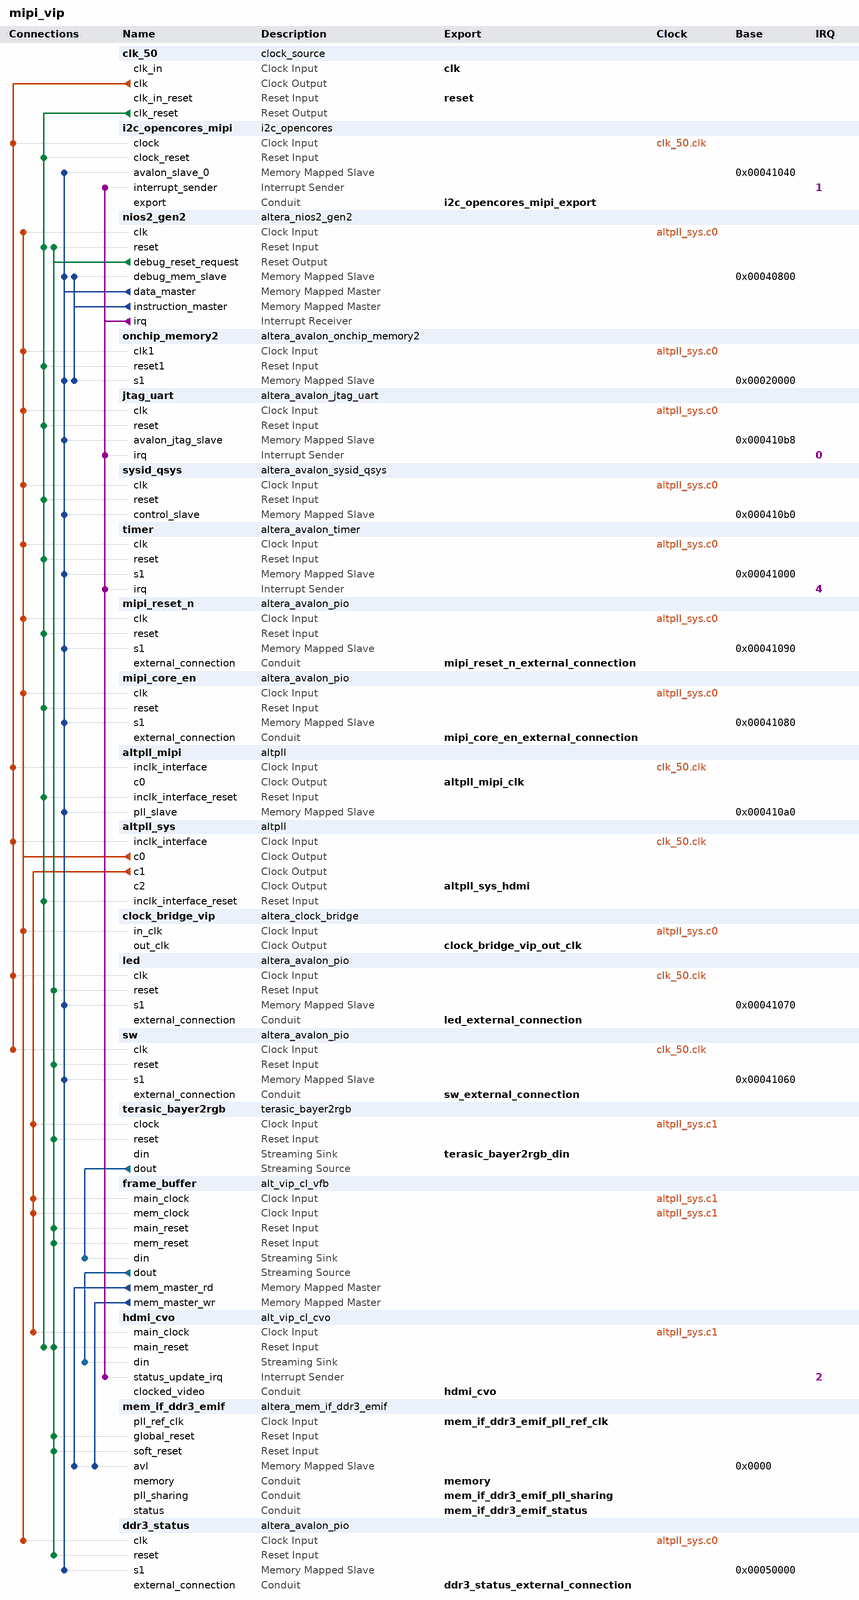
[diagram p0: system contents]
# Platform Designer (Qsys) system mipi_vip, MAX 10 10M50DAF484C6GES
# Parameters at their usual value, and those the tool derives, are not listed.
package require -exact qsys 15.0
create_system mipi_vip
set_project_property DEVICE_FAMILY {MAX 10}
set_project_property DEVICE 10M50DAF484C6GES

add_instance clk_50 clock_source 15.0
set_instance_parameter_value clk_50 clockFrequency 50000000

add_instance i2c_opencores_mipi i2c_opencores 12.0

add_instance nios2_gen2 altera_nios2_gen2 15.0
set_instance_parameter_value nios2_gen2 dcache_size 2048
set_instance_parameter_value nios2_gen2 exceptionSlave onchip_memory2.s1
set_instance_parameter_value nios2_gen2 icache_size 4096
set_instance_parameter_value nios2_gen2 impl Fast
set_instance_parameter_value nios2_gen2 resetSlave onchip_memory2.s1

add_instance onchip_memory2 altera_avalon_onchip_memory2 15.0
set_instance_parameter_value onchip_memory2 dataWidth 32
set_instance_parameter_value onchip_memory2 dualPort false
set_instance_parameter_value onchip_memory2 initMemContent true
set_instance_parameter_value onchip_memory2 initializationFileName "E:\\SVN\\deca\\amax10\\test\\richard\\DECA_MIPI\\software\\deca_mipi\\mem_init\\deca_qsys_onchip_memory2.hex"
set_instance_parameter_value onchip_memory2 memorySize 70000

add_instance jtag_uart altera_avalon_jtag_uart 15.0
set_instance_parameter_value jtag_uart simInteractiveOptions NO_INTERACTIVE_WINDOWS

add_instance sysid_qsys altera_avalon_sysid_qsys 15.0
set_instance_parameter_value sysid_qsys id 0

add_instance timer altera_avalon_timer 15.0
set_instance_parameter_value timer period 1
set_instance_parameter_value timer periodUnits MSEC

add_instance mipi_reset_n altera_avalon_pio 15.0
set_instance_parameter_value mipi_reset_n direction Output
set_instance_parameter_value mipi_reset_n resetValue 1
set_instance_parameter_value mipi_reset_n width 1

add_instance mipi_core_en altera_avalon_pio 15.0
set_instance_parameter_value mipi_core_en direction Output
set_instance_parameter_value mipi_core_en resetValue 1
set_instance_parameter_value mipi_core_en width 1

add_instance altpll_mipi altpll 15.0
set_instance_parameter_value altpll_mipi CLK0_DIVIDE_BY 25
set_instance_parameter_value altpll_mipi CLK0_MULTIPLY_BY 12
set_instance_parameter_value altpll_mipi INCLK0_INPUT_FREQUENCY 20000
set_instance_parameter_value altpll_mipi PORT_ARESET PORT_UNUSED
set_instance_parameter_value altpll_mipi PORT_LOCKED PORT_USED
set_instance_parameter_value altpll_mipi PORT_clk1 PORT_UNUSED
set_instance_parameter_value altpll_mipi PORT_clk2 PORT_UNUSED
set_instance_parameter_value altpll_mipi PORT_clk3 PORT_UNUSED

add_instance altpll_sys altpll 15.0
set_instance_parameter_value altpll_sys CLK0_DIVIDE_BY 1
set_instance_parameter_value altpll_sys CLK0_MULTIPLY_BY 2
set_instance_parameter_value altpll_sys CLK1_DIVIDE_BY 1
set_instance_parameter_value altpll_sys CLK1_DUTY_CYCLE 50
set_instance_parameter_value altpll_sys CLK1_MULTIPLY_BY 2
set_instance_parameter_value altpll_sys CLK1_PHASE_SHIFT 0
set_instance_parameter_value altpll_sys CLK2_DIVIDE_BY 10
set_instance_parameter_value altpll_sys CLK2_DUTY_CYCLE 50
set_instance_parameter_value altpll_sys CLK2_MULTIPLY_BY 13
set_instance_parameter_value altpll_sys CLK2_PHASE_SHIFT 0
set_instance_parameter_value altpll_sys INCLK0_INPUT_FREQUENCY 20000
set_instance_parameter_value altpll_sys PORT_ARESET PORT_UNUSED
set_instance_parameter_value altpll_sys PORT_LOCKED PORT_USED
set_instance_parameter_value altpll_sys PORT_clk1 PORT_USED
set_instance_parameter_value altpll_sys PORT_clk2 PORT_USED
set_instance_parameter_value altpll_sys PORT_clk3 PORT_UNUSED

add_instance clock_bridge_vip altera_clock_bridge 15.0
set_instance_parameter_value clock_bridge_vip DERIVED_CLOCK_RATE 100000000
set_instance_parameter_value clock_bridge_vip EXPLICIT_CLOCK_RATE 100000000

add_instance led altera_avalon_pio 15.0
set_instance_parameter_value led direction Output
set_instance_parameter_value led width 8

add_instance sw altera_avalon_pio 15.0
set_instance_parameter_value sw direction Input
set_instance_parameter_value sw width 2

add_instance terasic_bayer2rgb terasic_bayer2rgb 1.0
set_instance_parameter_value terasic_bayer2rgb RAW_BITS 8
set_instance_parameter_value terasic_bayer2rgb VIDEO_H 768
set_instance_parameter_value terasic_bayer2rgb VIDEO_W 1024

add_instance frame_buffer alt_vip_cl_vfb 15.0
set_instance_parameter_value frame_buffer CLOCKS_ARE_SEPARATE 1
set_instance_parameter_value frame_buffer CORRECT_INVALID_FIELDS 0
set_instance_parameter_value frame_buffer DROP_FRAMES 0
set_instance_parameter_value frame_buffer FAMILY {MAX 10}
set_instance_parameter_value frame_buffer IS_FRAME_READER 0
set_instance_parameter_value frame_buffer MAX_HEIGHT 768
set_instance_parameter_value frame_buffer MAX_WIDTH 1024
set_instance_parameter_value frame_buffer MEM_BASE_ADDR 0
set_instance_parameter_value frame_buffer MEM_PORT_WIDTH 128
set_instance_parameter_value frame_buffer READER_RUNTIME_CONTROL 0
set_instance_parameter_value frame_buffer READ_BURST_TARGET 64
set_instance_parameter_value frame_buffer READ_FIFO_DEPTH 128
set_instance_parameter_value frame_buffer USER_PACKETS_MAX_STORAGE 0
set_instance_parameter_value frame_buffer WRITE_BURST_TARGET 64
set_instance_parameter_value frame_buffer WRITE_FIFO_DEPTH 128

add_instance hdmi_cvo alt_vip_cl_cvo 15.0
set_instance_parameter_value hdmi_cvo ACCEPT_COLOURS_IN_SEQ 0
set_instance_parameter_value hdmi_cvo ANC_LINE 0
set_instance_parameter_value hdmi_cvo AP_LINE 0
set_instance_parameter_value hdmi_cvo BPS 8
set_instance_parameter_value hdmi_cvo CLOCKS_ARE_SAME 0
set_instance_parameter_value hdmi_cvo COLOUR_PLANES_ARE_IN_PARALLEL 1
set_instance_parameter_value hdmi_cvo CONTEXT_WIDTH 8
set_instance_parameter_value hdmi_cvo DST_WIDTH 8
set_instance_parameter_value hdmi_cvo FIELD0_ANC_LINE 0
set_instance_parameter_value hdmi_cvo FIELD0_V_BACK_PORCH 0
set_instance_parameter_value hdmi_cvo FIELD0_V_BLANK 0
set_instance_parameter_value hdmi_cvo FIELD0_V_FRONT_PORCH 0
set_instance_parameter_value hdmi_cvo FIELD0_V_RISING_EDGE 0
set_instance_parameter_value hdmi_cvo FIELD0_V_SYNC_LENGTH 0
set_instance_parameter_value hdmi_cvo FIFO_DEPTH 1024
set_instance_parameter_value hdmi_cvo F_FALLING_EDGE 0
set_instance_parameter_value hdmi_cvo F_RISING_EDGE 0
set_instance_parameter_value hdmi_cvo GENERATE_SYNC 0
set_instance_parameter_value hdmi_cvo H_ACTIVE_PIXELS 1024
set_instance_parameter_value hdmi_cvo H_BACK_PORCH 160
set_instance_parameter_value hdmi_cvo H_BLANK 0
set_instance_parameter_value hdmi_cvo H_FRONT_PORCH 24
set_instance_parameter_value hdmi_cvo H_SYNC_LENGTH 136
set_instance_parameter_value hdmi_cvo INTERLACED 0
set_instance_parameter_value hdmi_cvo NO_OF_CHANNELS 1
set_instance_parameter_value hdmi_cvo NO_OF_MODES 1
set_instance_parameter_value hdmi_cvo NUMBER_OF_COLOUR_PLANES 3
set_instance_parameter_value hdmi_cvo PIXELS_IN_PARALLEL 1
set_instance_parameter_value hdmi_cvo SRC_WIDTH 8
set_instance_parameter_value hdmi_cvo STD_WIDTH 1
set_instance_parameter_value hdmi_cvo TASK_WIDTH 8
set_instance_parameter_value hdmi_cvo THRESHOLD 1023
set_instance_parameter_value hdmi_cvo USE_CONTROL 0
set_instance_parameter_value hdmi_cvo USE_EMBEDDED_SYNCS 0
set_instance_parameter_value hdmi_cvo V_ACTIVE_LINES 768
set_instance_parameter_value hdmi_cvo V_BACK_PORCH 29
set_instance_parameter_value hdmi_cvo V_BLANK 0
set_instance_parameter_value hdmi_cvo V_FRONT_PORCH 3
set_instance_parameter_value hdmi_cvo V_SYNC_LENGTH 6

add_instance mem_if_ddr3_emif altera_mem_if_ddr3_emif 15.0
set_instance_parameter_value mem_if_ddr3_emif AVL_MAX_SIZE 4
set_instance_parameter_value mem_if_ddr3_emif CALIBRATION_MODE Skip
set_instance_parameter_value mem_if_ddr3_emif CPORT_TYPE_PORT Bidirectional,Bidirectional,Bidirectional,Bidirectional,Bidirectional,Bidirectional
set_instance_parameter_value mem_if_ddr3_emif EXPORT_AFI_HALF_CLK false
set_instance_parameter_value mem_if_ddr3_emif HARD_EMIF false
set_instance_parameter_value mem_if_ddr3_emif MEM_BANKADDR_WIDTH 3
set_instance_parameter_value mem_if_ddr3_emif MEM_CLK_FREQ 300.0
set_instance_parameter_value mem_if_ddr3_emif MEM_CLK_FREQ_MAX 800.0
set_instance_parameter_value mem_if_ddr3_emif MEM_COL_ADDR_WIDTH 10
set_instance_parameter_value mem_if_ddr3_emif MEM_DQ_WIDTH 16
set_instance_parameter_value mem_if_ddr3_emif MEM_FORMAT DISCRETE
set_instance_parameter_value mem_if_ddr3_emif MEM_ROW_ADDR_WIDTH 15
set_instance_parameter_value mem_if_ddr3_emif MEM_TCL 7
set_instance_parameter_value mem_if_ddr3_emif MEM_TFAW_NS 45.0
set_instance_parameter_value mem_if_ddr3_emif MEM_TRAS_NS 35.0
set_instance_parameter_value mem_if_ddr3_emif MEM_TRCD_NS 13.75
set_instance_parameter_value mem_if_ddr3_emif MEM_TRFC_NS 260.0
set_instance_parameter_value mem_if_ddr3_emif MEM_TRP_NS 13.75
set_instance_parameter_value mem_if_ddr3_emif MEM_TRRD_NS 7.5
set_instance_parameter_value mem_if_ddr3_emif MEM_TRTP_NS 7.5
set_instance_parameter_value mem_if_ddr3_emif MEM_TWTR 6
set_instance_parameter_value mem_if_ddr3_emif MEM_VENDOR Micron
set_instance_parameter_value mem_if_ddr3_emif MEM_WTCL 6
set_instance_parameter_value mem_if_ddr3_emif PLL_LOCATION Top_Bottom
set_instance_parameter_value mem_if_ddr3_emif POWER_OF_TWO_BUS true
set_instance_parameter_value mem_if_ddr3_emif PRIORITY_PORT 1,1,1,1,1,1
set_instance_parameter_value mem_if_ddr3_emif RATE Half
set_instance_parameter_value mem_if_ddr3_emif REF_CLK_FREQ 50.0
set_instance_parameter_value mem_if_ddr3_emif SPEED_GRADE 6
set_instance_parameter_value mem_if_ddr3_emif TIMING_BOARD_AC_SKEW 0.017
set_instance_parameter_value mem_if_ddr3_emif TIMING_BOARD_AC_TO_CK_SKEW -1.3E-4
set_instance_parameter_value mem_if_ddr3_emif TIMING_BOARD_DQ_TO_DQS_SKEW -6.0E-4
set_instance_parameter_value mem_if_ddr3_emif TIMING_BOARD_MAX_CK_DELAY 0.183
set_instance_parameter_value mem_if_ddr3_emif TIMING_BOARD_MAX_DQS_DELAY 0.181
set_instance_parameter_value mem_if_ddr3_emif TIMING_BOARD_SKEW_BETWEEN_DQS 0.005
set_instance_parameter_value mem_if_ddr3_emif TIMING_BOARD_SKEW_CKDQS_DIMM_MAX 0.007
set_instance_parameter_value mem_if_ddr3_emif TIMING_BOARD_SKEW_CKDQS_DIMM_MIN 0.002
set_instance_parameter_value mem_if_ddr3_emif TIMING_BOARD_SKEW_WITHIN_DQS 0.008
set_instance_parameter_value mem_if_ddr3_emif TIMING_TDH 55
set_instance_parameter_value mem_if_ddr3_emif TIMING_TDQSCK 225
set_instance_parameter_value mem_if_ddr3_emif TIMING_TDQSQ 125
set_instance_parameter_value mem_if_ddr3_emif TIMING_TDQSS 0.25
set_instance_parameter_value mem_if_ddr3_emif TIMING_TDS 55
set_instance_parameter_value mem_if_ddr3_emif TIMING_TDSH 0.2
set_instance_parameter_value mem_if_ddr3_emif TIMING_TDSS 0.2
set_instance_parameter_value mem_if_ddr3_emif TIMING_TIH 130
set_instance_parameter_value mem_if_ddr3_emif TIMING_TIS 185
set_instance_parameter_value mem_if_ddr3_emif TIMING_TQSH 0.4
set_instance_parameter_value mem_if_ddr3_emif USER_DEBUG_LEVEL 1

add_instance ddr3_status altera_avalon_pio 15.0
set_instance_parameter_value ddr3_status direction Input
set_instance_parameter_value ddr3_status width 4

# connections
add_connection altpll_sys.c0 clock_bridge_vip.in_clk clock
add_connection altpll_sys.c0 ddr3_status.clk clock
add_connection altpll_sys.c0 jtag_uart.clk clock
add_connection altpll_sys.c0 mipi_core_en.clk clock
add_connection altpll_sys.c0 mipi_reset_n.clk clock
add_connection altpll_sys.c0 nios2_gen2.clk clock
add_connection altpll_sys.c0 onchip_memory2.clk1 clock
add_connection altpll_sys.c0 sysid_qsys.clk clock
add_connection altpll_sys.c0 timer.clk clock
add_connection altpll_sys.c1 frame_buffer.main_clock clock
add_connection altpll_sys.c1 frame_buffer.mem_clock clock
add_connection altpll_sys.c1 hdmi_cvo.main_clock clock
add_connection altpll_sys.c1 terasic_bayer2rgb.clock clock
add_connection clk_50.clk altpll_mipi.inclk_interface clock
add_connection clk_50.clk altpll_sys.inclk_interface clock
add_connection clk_50.clk i2c_opencores_mipi.clock clock
add_connection clk_50.clk led.clk clock
add_connection clk_50.clk sw.clk clock
add_connection clk_50.clk_reset altpll_mipi.inclk_interface_reset reset
add_connection clk_50.clk_reset altpll_sys.inclk_interface_reset reset
add_connection clk_50.clk_reset hdmi_cvo.main_reset reset
add_connection clk_50.clk_reset i2c_opencores_mipi.clock_reset reset
add_connection clk_50.clk_reset jtag_uart.reset reset
add_connection clk_50.clk_reset mipi_core_en.reset reset
add_connection clk_50.clk_reset mipi_reset_n.reset reset
add_connection clk_50.clk_reset nios2_gen2.reset reset
add_connection clk_50.clk_reset onchip_memory2.reset1 reset
add_connection clk_50.clk_reset sysid_qsys.reset reset
add_connection clk_50.clk_reset timer.reset reset
add_connection nios2_gen2.debug_reset_request ddr3_status.reset reset
add_connection nios2_gen2.debug_reset_request frame_buffer.main_reset reset
add_connection nios2_gen2.debug_reset_request frame_buffer.mem_reset reset
add_connection nios2_gen2.debug_reset_request hdmi_cvo.main_reset reset
add_connection nios2_gen2.debug_reset_request led.reset reset
add_connection nios2_gen2.debug_reset_request mem_if_ddr3_emif.global_reset reset
add_connection nios2_gen2.debug_reset_request mem_if_ddr3_emif.soft_reset reset
add_connection nios2_gen2.debug_reset_request nios2_gen2.reset reset
add_connection nios2_gen2.debug_reset_request sw.reset reset
add_connection nios2_gen2.debug_reset_request terasic_bayer2rgb.reset reset
add_connection frame_buffer.mem_master_rd mem_if_ddr3_emif.avl avalon
set_connection_parameter_value frame_buffer.mem_master_rd/mem_if_ddr3_emif.avl arbitrationPriority 10
set_connection_parameter_value frame_buffer.mem_master_rd/mem_if_ddr3_emif.avl baseAddress 0x0000
add_connection frame_buffer.mem_master_wr mem_if_ddr3_emif.avl avalon
set_connection_parameter_value frame_buffer.mem_master_wr/mem_if_ddr3_emif.avl arbitrationPriority 10
set_connection_parameter_value frame_buffer.mem_master_wr/mem_if_ddr3_emif.avl baseAddress 0x0000
add_connection nios2_gen2.data_master altpll_mipi.pll_slave avalon
set_connection_parameter_value nios2_gen2.data_master/altpll_mipi.pll_slave baseAddress 0x000410a0
add_connection nios2_gen2.data_master ddr3_status.s1 avalon
set_connection_parameter_value nios2_gen2.data_master/ddr3_status.s1 baseAddress 0x00050000
add_connection nios2_gen2.data_master i2c_opencores_mipi.avalon_slave_0 avalon
set_connection_parameter_value nios2_gen2.data_master/i2c_opencores_mipi.avalon_slave_0 baseAddress 0x00041040
add_connection nios2_gen2.data_master jtag_uart.avalon_jtag_slave avalon
set_connection_parameter_value nios2_gen2.data_master/jtag_uart.avalon_jtag_slave baseAddress 0x000410b8
add_connection nios2_gen2.data_master led.s1 avalon
set_connection_parameter_value nios2_gen2.data_master/led.s1 baseAddress 0x00041070
add_connection nios2_gen2.data_master mipi_core_en.s1 avalon
set_connection_parameter_value nios2_gen2.data_master/mipi_core_en.s1 baseAddress 0x00041080
add_connection nios2_gen2.data_master mipi_reset_n.s1 avalon
set_connection_parameter_value nios2_gen2.data_master/mipi_reset_n.s1 baseAddress 0x00041090
add_connection nios2_gen2.data_master nios2_gen2.debug_mem_slave avalon
set_connection_parameter_value nios2_gen2.data_master/nios2_gen2.debug_mem_slave baseAddress 0x00040800
add_connection nios2_gen2.data_master onchip_memory2.s1 avalon
set_connection_parameter_value nios2_gen2.data_master/onchip_memory2.s1 baseAddress 0x00020000
add_connection nios2_gen2.data_master sw.s1 avalon
set_connection_parameter_value nios2_gen2.data_master/sw.s1 baseAddress 0x00041060
add_connection nios2_gen2.data_master sysid_qsys.control_slave avalon
set_connection_parameter_value nios2_gen2.data_master/sysid_qsys.control_slave baseAddress 0x000410b0
add_connection nios2_gen2.data_master timer.s1 avalon
set_connection_parameter_value nios2_gen2.data_master/timer.s1 baseAddress 0x00041000
add_connection nios2_gen2.instruction_master nios2_gen2.debug_mem_slave avalon
set_connection_parameter_value nios2_gen2.instruction_master/nios2_gen2.debug_mem_slave baseAddress 0x00040800
add_connection nios2_gen2.instruction_master onchip_memory2.s1 avalon
set_connection_parameter_value nios2_gen2.instruction_master/onchip_memory2.s1 baseAddress 0x00020000
add_connection frame_buffer.dout hdmi_cvo.din avalon_streaming
add_connection terasic_bayer2rgb.dout frame_buffer.din avalon_streaming
add_connection nios2_gen2.irq hdmi_cvo.status_update_irq interrupt
set_connection_parameter_value nios2_gen2.irq/hdmi_cvo.status_update_irq irqNumber 2
add_connection nios2_gen2.irq i2c_opencores_mipi.interrupt_sender interrupt
set_connection_parameter_value nios2_gen2.irq/i2c_opencores_mipi.interrupt_sender irqNumber 1
add_connection nios2_gen2.irq jtag_uart.irq interrupt
set_connection_parameter_value nios2_gen2.irq/jtag_uart.irq irqNumber 0
add_connection nios2_gen2.irq timer.irq interrupt
set_connection_parameter_value nios2_gen2.irq/timer.irq irqNumber 4

# exported interfaces
add_interface altpll_mipi_clk clock source
set_interface_property altpll_mipi_clk EXPORT_OF altpll_mipi.c0
add_interface altpll_sys_hdmi clock source
set_interface_property altpll_sys_hdmi EXPORT_OF altpll_sys.c2
add_interface clk clock sink
set_interface_property clk EXPORT_OF clk_50.clk_in
add_interface clock_bridge_vip_out_clk clock source
set_interface_property clock_bridge_vip_out_clk EXPORT_OF clock_bridge_vip.out_clk
add_interface ddr3_status_external_connection conduit end
set_interface_property ddr3_status_external_connection EXPORT_OF ddr3_status.external_connection
add_interface hdmi_cvo conduit end
set_interface_property hdmi_cvo EXPORT_OF hdmi_cvo.clocked_video
add_interface i2c_opencores_mipi_export conduit end
set_interface_property i2c_opencores_mipi_export EXPORT_OF i2c_opencores_mipi.export
add_interface led_external_connection conduit end
set_interface_property led_external_connection EXPORT_OF led.external_connection
add_interface mem_if_ddr3_emif_pll_ref_clk clock sink
set_interface_property mem_if_ddr3_emif_pll_ref_clk EXPORT_OF mem_if_ddr3_emif.pll_ref_clk
add_interface mem_if_ddr3_emif_pll_sharing conduit end
set_interface_property mem_if_ddr3_emif_pll_sharing EXPORT_OF mem_if_ddr3_emif.pll_sharing
add_interface mem_if_ddr3_emif_status conduit end
set_interface_property mem_if_ddr3_emif_status EXPORT_OF mem_if_ddr3_emif.status
add_interface memory conduit end
set_interface_property memory EXPORT_OF mem_if_ddr3_emif.memory
add_interface mipi_core_en_external_connection conduit end
set_interface_property mipi_core_en_external_connection EXPORT_OF mipi_core_en.external_connection
add_interface mipi_reset_n_external_connection conduit end
set_interface_property mipi_reset_n_external_connection EXPORT_OF mipi_reset_n.external_connection
add_interface reset reset sink
set_interface_property reset EXPORT_OF clk_50.clk_in_reset
add_interface sw_external_connection conduit end
set_interface_property sw_external_connection EXPORT_OF sw.external_connection
add_interface terasic_bayer2rgb_din avalon_streaming sink
set_interface_property terasic_bayer2rgb_din EXPORT_OF terasic_bayer2rgb.din

set_interconnect_requirement {$system} qsys_mm.clockCrossingAdapter HANDSHAKE
set_interconnect_requirement {$system} qsys_mm.insertDefaultSlave FALSE
set_interconnect_requirement {$system} qsys_mm.maxAdditionalLatency 1

save_system mipi_vip.qsys
